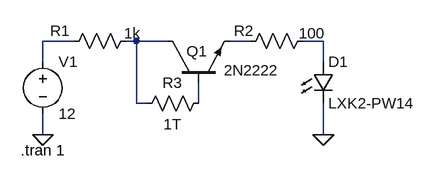
[diagram p0: schematic FlashLed.asc]
FlashLed.asc, the LTspice schematic file:
Version 4
SHEET 1 880 680
WIRE 96 48 48 48
WIRE 192 48 176 48
WIRE 240 48 192 48
WIRE 368 48 336 48
WIRE 480 48 448 48
WIRE 48 80 48 48
WIRE 480 80 480 48
WIRE 192 144 192 48
WIRE 208 144 192 144
WIRE 288 144 288 112
WIRE 48 192 48 160
WIRE 480 192 480 144
FLAG 48 192 0
FLAG 480 192 0
SYMBOL voltage 48 64 R0
SYMATTR InstName V1
SYMATTR Value 12
SYMBOL res 192 32 R90
WINDOW 0 16 117 VBottom 0
WINDOW 3 -12 6 VTop 0
SYMATTR InstName R1
SYMATTR Value 1k
SYMBOL npn2 240 112 R270
WINDOW 0 48 29 VRight 0
WINDOW 3 19 87 VRight 0
SYMATTR InstName Q1
SYMATTR Value 2N2222
SYMBOL res 464 32 R90
WINDOW 0 16 106 VBottom 0
WINDOW 3 -12 1 VTop 0
SYMATTR InstName R2
SYMATTR Value 100
SYMBOL LED 464 80 R0
SYMATTR InstName D1
SYMATTR Value LXK2-PW14
SYMBOL res 304 128 R90
WINDOW 0 0 56 VBottom 0
WINDOW 3 32 56 VTop 0
SYMATTR InstName R3
SYMATTR Value 1T
TEXT 14 216 Left 0 !.tran 1

The netlist it stands for:
* FlashLed.asc
V1 N001 0 12
R1 N002 N001 1k
Q1 N002 N005 N003 0 2N2222
R2 N004 N003 100
D1 N004 0 LXK2-PW14
R3 N005 N002 1T
.model D D
.lib standard.dio
.model NPN NPN
.model PNP PNP
.lib standard.bjt
.tran 1
.backanno
.end